# EAGLE design RS323_DB9 (EAGLE 6.4)
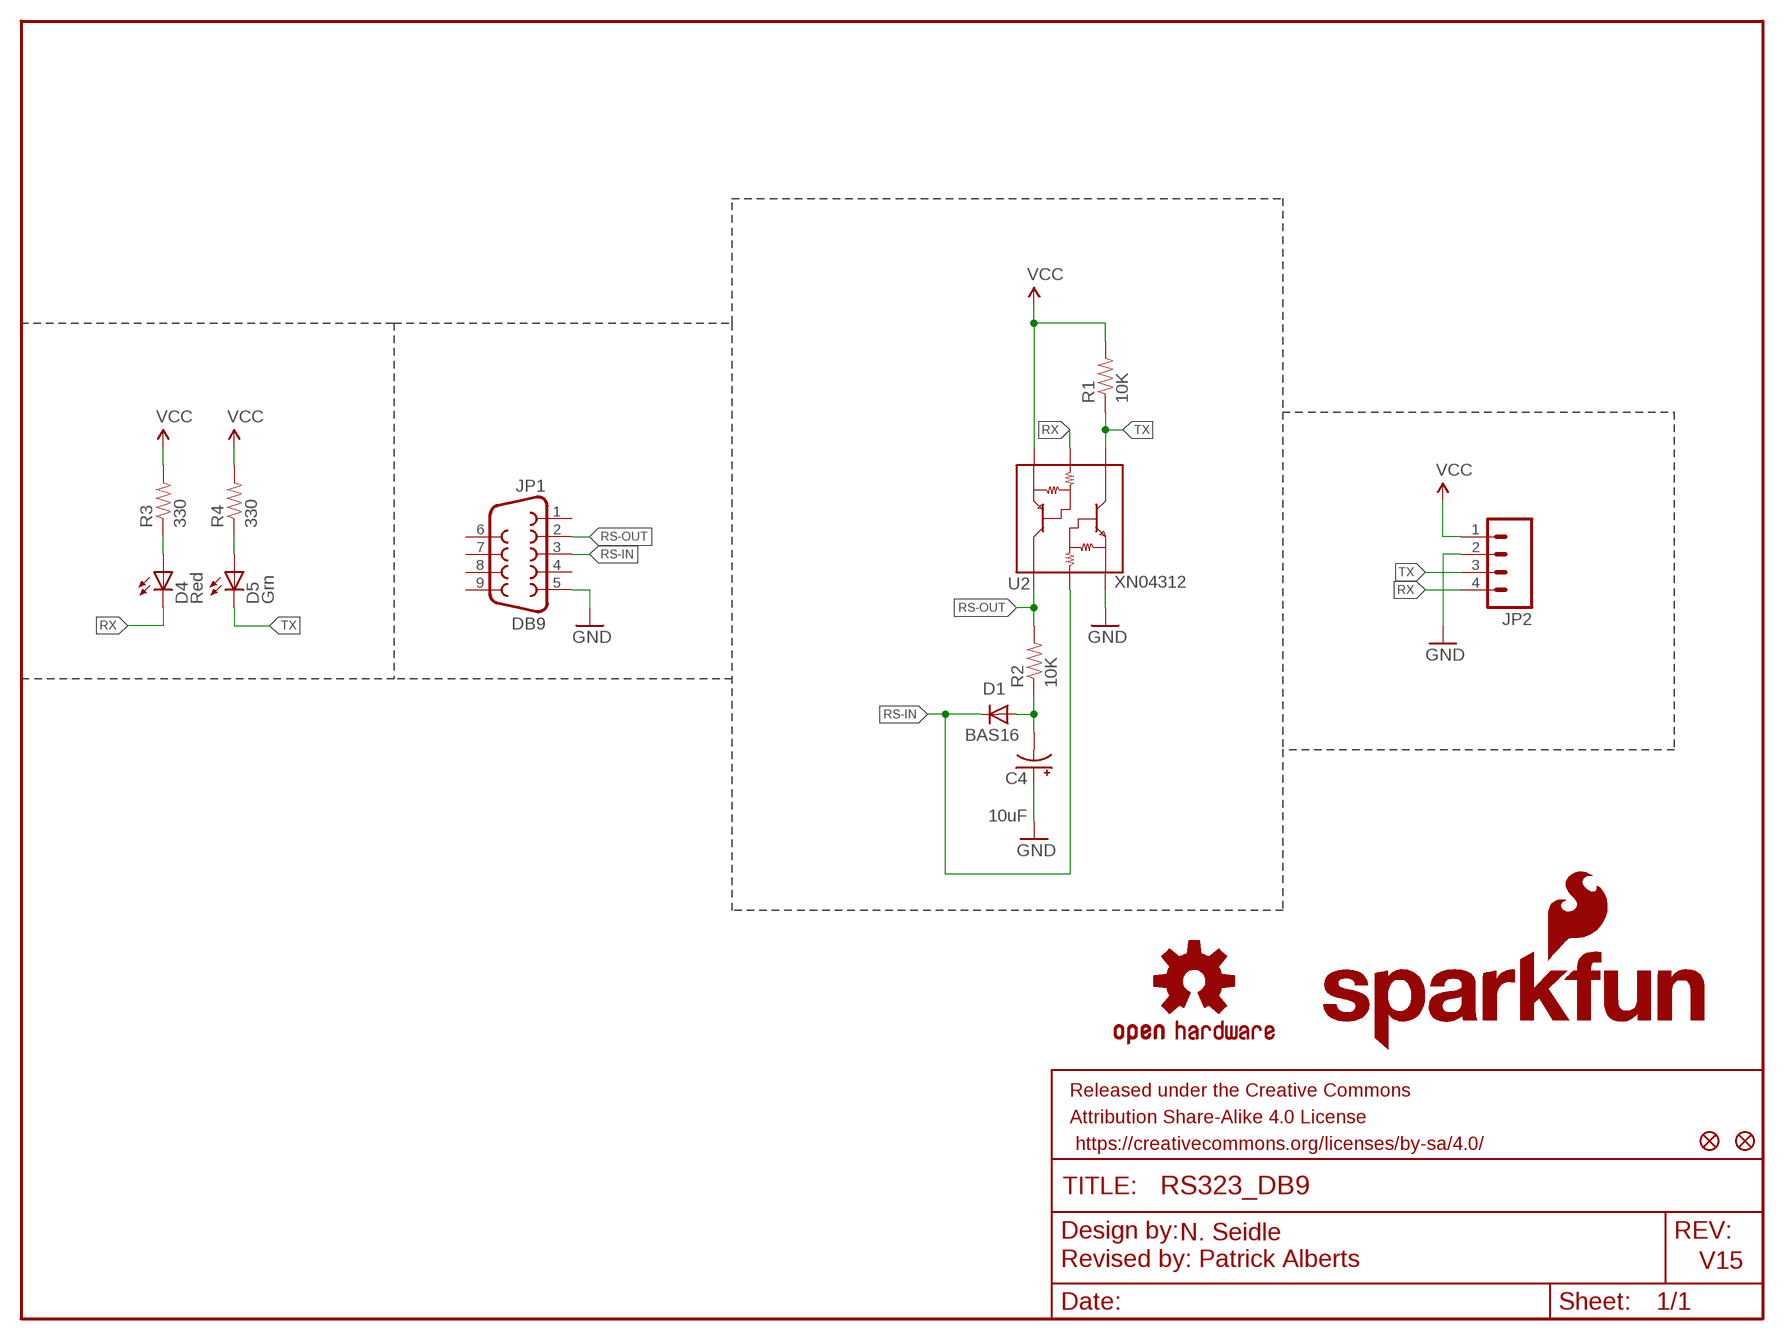
[diagram p0: schematic, sheet 1]

## Parts
C4  10uF  CAP_POL1206  [EIA3216]
D1  BAS16  DIODESOD  [SOD-323]
D4  Red  LED1206  [LED-1206]
D5  Grn  LED1206  [LED-1206]
E$1  FIDUCIAL1X2  [FIDUCIAL-1X2]
E$2  FIDUCIAL1X2  [FIDUCIAL-1X2]
FRAME1  FRAME-LETTER  [CREATIVE_COMMONS]
JP1  DB9  DB9FEMALE  [DB9]
JP2  M04PTH  [1X04]
LOGO1  SFE_LOGO_NAME_FLAME.1_INCH  [SFE_LOGO_NAME_FLAME_.1]
LOGO2  OSHW-LOGOM  [OSHW-LOGO-M]
R1  10K  10KOHM1/10W1%(0603)0603  [0603-RES]
R2  10K  10KOHM1/10W1%(0603)0603  [0603-RES]
R3  330  330OHM1/10W1%(0603)  [0603-RES]
R4  330  330OHM1/10W1%(0603)  [0603-RES]
U2  XN04312  XN04312SOT  [SOT23-6]

## Nets
GND: C4.A(+) JP1.5 JP2.2 U2.6(E1)
N$1: D4.A R3.1
N$2: D5.A R4.1
N$4: C4.C(-) D1.2(A) R2.1
RS-IN: D1.1(C) JP1.3 U2.5(B1)
RS-OUT: JP1.2 R2.2 U2.4(C2)
RX: D4.C JP2.4 U2.2(B2)
TX: D5.C JP2.3 R1.1 U2.1(C1)
VCC: JP2.1 R1.2 R3.2 R4.2 U2.3(E2)
Unconnected: JP1.1 JP1.4 JP1.6 JP1.7 JP1.8 JP1.9

## Notes on the sheet
- N. Seidle
- Revised by: Patrick Alberts | V15

## Library data of the parts
C4 = SparkFun:CAP_POL: Capacitor Polarized These are standard SMD and PTH capacitors. Normally 10uF, 47uF, and 100uF in electrolytic and tantalum varieties. Always verify the external diameter of the through hole cap, it varies with capacity, voltage, and manufacturer. The EIA devices should be standard.
D1 = SparkFun:DIODE: Diode These are standard reverse protection diodes and small signal diodes. SMA package can handle up to about 1A. SOD-323 can handle about 200mA. What the SOD-323 package when ordering, there are some mfgs out there that are 5-pin packages.
D4 D5 = SparkFun:LED: LEDs Standard schematic elements and footprints for 5mm, 3mm, 1206, and 0603 sized LEDs. 5mm - Spark Fun Electronics SKU : COM-00529 (and others)
E$1 E$2 = SparkFun:FIDUCIAL: Fiducial Alignment Points Various fiducial points for machine vision alignment.
FRAME1 = SparkFun-Aesthetics:FRAME-LETTER: Schematic Frame Standard 8.5x11 US Letter frame; DESIGNER: NAME; VERSION: v01
JP1 = SparkFun-Connectors:DB9: DB9 Connector Standard DB9 (D-Sub 9) serial connector. Can be used for CAN bus as well as RS485 and RS232. Footprint production proven. Spark Fun Electronics SKU : PRT-00429
JP2 = SparkFun-Connectors:M04: Header 4 Standard 4-pin 0.1" header. Use with straight break away headers (SKU : PRT-00116), right angle break away headers (PRT-00553), swiss pins (PRT-00743), machine pins (PRT-00117), and female headers (PRT-00115). Molex polarized connector foot print use with SKU : PRT-08231 with associated crimp pins and housings. 1MM SMD Version SKU: PRT-10208
LOGO1 = SparkFun-Aesthetics:SFE_LOGO_NAME_FLAME: SFE Logo, name and flame This is the SparkFun full logo. The logo on the schematic will always be the same size; the package variant is the height of the flame part of the logo. Default layer for the logo on the board is tSilk.
LOGO2 = SparkFun-Aesthetics:OSHW-LOGO: Open Source Hardware Logo This logo indicates the piece of hardware it is found on incorporates a OSHW license and/or adheres to the definition of open source hardware found here: http://freedomdefined.org/OSHW
R1 R2 = SparkFun-Resistors:10KOHM1/10W1%(0603): RES-00824; PROD_ID: RES-00824
R3 R4 = SparkFun-Resistors:330OHM1/10W1%(0603): RES-00818; PROD_ID: RES-00818
U2 = SparkFun:XN04312: NPN/PNP Transistor Array Handy dandy transistor array for level shifting and inverting signals. Spark Fun Electronics SKU : COM-00588

## Net classes
0 default: width 0.203 mm
1 power: width 0.203 mm

## Board
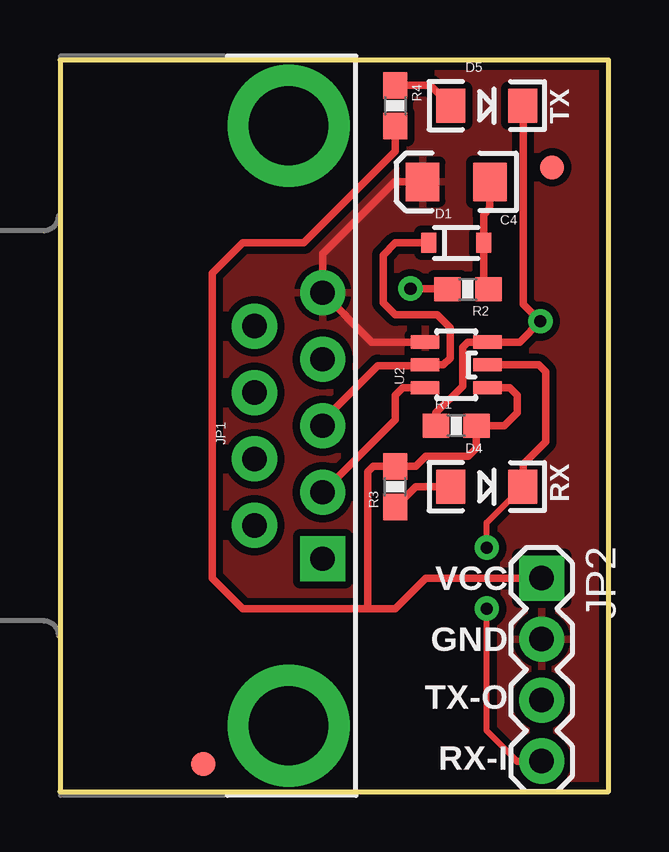
[diagram p1: board, top side]
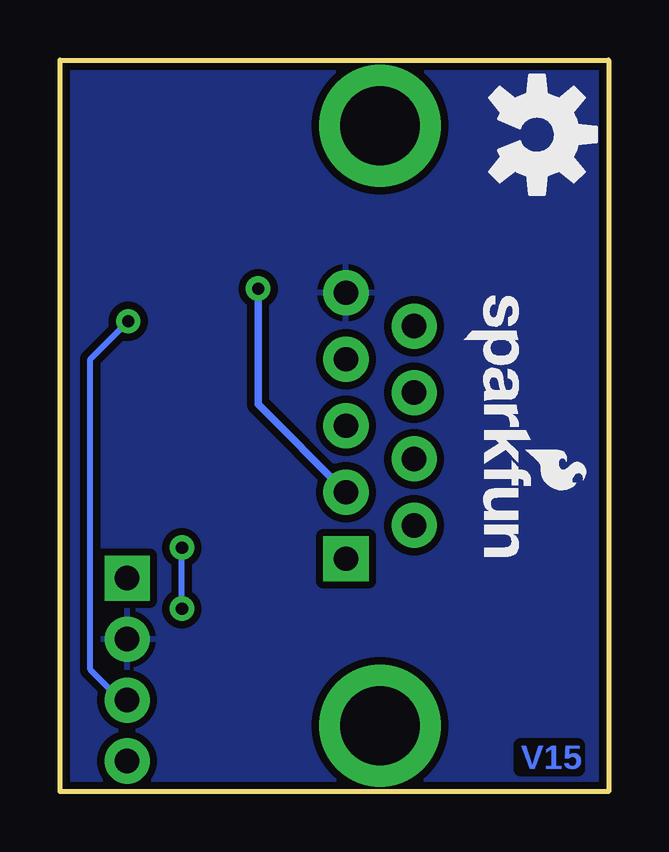
[diagram p2: board, bottom side, seen from below]

Size 22.86 x 30.48 mm. Coordinates in mm from the lower left corner, seen from the top.
Outline: 0,0 22.86,0 22.86,30.48 0,30.48 0,0
Copper layers (1*16): Top 0.035mm / dielectric 1.5mm / Bottom 0.035mm
Design rules "SparkFun-2-layer": minimum track width 7mil, minimum drill 15mil, track to track 8mil, track to pad 8mil, pad to pad 8mil, via to via 8mil, smd to smd 8mil, copper to edge 8mil, drill to drill 8mil, minimum pad ring 12mil, minimum via ring 10mil, stop-mask expansion 4mil, vias tented up to drill 20mil, thermal gap 10mil

### Footprints (pad centres in the part's own frame; a part is rotated, then mirrored left to right if it is on the bottom)
EIA3216 = smd 1.4 x 1.6: A 1.4,0; C -1.4,0
SOD-323 = smd 0.63 x 0.83: 1 -1.15,0; 2 1.15,0
LED-1206 = smd 1.2 x 1.4: A -1.5,0; C 1.5,0
FIDUCIAL-1X2 = smd 1 x 1: 1 0,0
DB9 = drill 1.016 pad 1.88 square: 1 -5.54,-1.42 | drill 1.016 pad 1.88: 2 -2.77,-1.42; 3 0,-1.42; 4 2.77,-1.42; 5 5.54,-1.42; 6 -4.15,1.42; 7 -1.38,1.42; 8 1.38,1.42; 9 4.15,1.42 | drill 3.302 pad 5.08: G1 -12.5,0; G2 12.5,0
1X04 = drill 1.016 pad 1.88 square: 1 0,0 | drill 1.016 pad 1.88: 2 2.54,0; 3 5.08,0; 4 7.62,0
0603-RES = smd 1.1 x 1: 1 -0.85,0; 2 0.85,0
SOT23-6 = smd 0.55 x 1.2: 1 0.95,-1.3; 2 0,-1.3; 3 -0.95,-1.3; 4 -0.95,1.3; 5 0,1.3; 6 0.95,1.3

### Placement (x,y rotation side)
C4  16.51,25.4 180 top
D1  16.51,22.86 0 top
D4  17.78,12.7 0 top
D5  17.78,28.57 0 top
E$1  5.97,1.14 0 top
E$2  20.51,26.01 0 top
FRAME1  -16.69,-13.97 0 top  (outside the outline)
JP1  9.53,15.24 90 top
JP2  20.07,8.89 270 top
LOGO1  6.13,21.11 270 bottom
LOGO2  2.99,27.37 270 bottom
R1  16.51,15.24 0 top
R2  17,20.92 180 top
R3  13.97,12.7 90 top
R4  13.97,28.57 270 top
U2  16.51,17.78 90 top

### Tracks (layer width: path | path; a pad name or v marks a point on that pad's centre or on a via)
GND
  Top 0.305: 15.24,25.4 C4.A 13.95,25.4 10.95,22.41 JP1.5 | 10.95,20.8 JP1.5 | U2.6 12.99,18.73 JP1.5
  pour Bottom (isolate 0.305): 0,30.48 22.86,30.48 22.86,0 0,0
  pour Top (isolate 0.305): 0,0 0,30.48 22.86,30.48 22.86,0
N$1
  Top 0.305: 16.51,12.7 D4.A 14.82,12.7 R3.1
N$2
  Top 0.254: 16.26,28.57 15.88,28.57
  Top 0.305: 16.26,28.57 D5.A 15.43,29.43 R4.1
N$4
  Top 0.305: 17.78,25.4 C4.C 17.91,24.3 17.65,24.04 D1.2 | D1.2 17.78,22.98 | 17.78,22.86 D1.2 | R2.1 17.66,21.11 D1.2
RS-IN
  Top 0.305: U2.5 15.24,17.78 | U2.5 15.98,17.78 16.26,18.06 16.26,19.33 15.72,19.86 13.97,19.86 13.46,20.37 13.46,22.35 13.97,22.86 D1.1 | JP1.3 10.95,15.45 13.24,17.75 15.18,17.75 U2.5
RS-OUT  (via drill 0.51)
  Top 0.305: v14.61,20.95 16.12,20.95 R2.2 | U2.4 14.29,16.83 13.97,16.51 13.97,15.49 11.3,12.83 JP1.2
  Bottom 0.305: JP1.2 14.61,16.13 v14.61,20.95
RX  (via drill 0.51)
  Top 0.254: 19.05,1.27 17.78,2.54 v17.78,7.62 | v17.78,10.16 17.78,11.2 D4.C
  Top 0.305: D4.C 19.05,12.7 | D4.C 19.28,12.8 19.3,12.83 19.3,13.64 20.23,14.57 20.23,17.49 19.95,17.77 U2.2 | 19.3,12.7 D4.C | JP2.4 19.05,1.27 | 19.3,12.68 D4.C
  Bottom 0.254: v17.78,7.62 v17.78,10.16
TX  (via drill 0.51)
  Top 0.305: D5.C 19.28,28.47 19.3,28.45 19.3,20.31 v20.02,19.6 19.15,18.73 U2.1 16.98,18.72 16.78,18.51 16.78,16.89 15.66,15.77 R1.1
  Bottom 0.254: JP2.3 20.32,3.81 21.59,5.08 21.59,18.02 v20.02,19.6
  Bottom 0.305: 20.32,19.29 v20.02,19.6
VCC
  Top 0.254: 17.82,16.82 U2.3
  Top 0.305: R4.2 13.97,27.94 | 13.97,27.56 R4.2 | U2.3 18.73,16.83 19.05,16.51 19.05,15.78 18.51,15.24 R1.2 17.35,14.3 17.02,13.97 15.24,13.97 14.82,13.55 R3.2 13.04,13.55 12.81,13.32 12.81,7.63 12.83,7.62 | R4.2 13.97,26.67 10.16,22.86 7.62,22.86 6.35,21.59 6.35,8.89 7.62,7.62 12.83,7.62 | 12.83,7.62 13.97,7.62 15.24,8.89 JP2.1

### Text on the board
Bottom: V15
tPlace: TX | RX | VCC | GND | TX-O | RX-I
tDocu: N. Seidle | Revised by: Patrick Alberts